# Altium project MB1428.PrjPcb (part 3 of 4)

## Sheet USB_PD_TYPE-C.SchDoc: USB_PD_TYPE-C
size A4; Date: Not used; ApprovedBy: Not used; CheckedBy: Not used; Author: Not used; CompanyName: STMicroelectronics; DrawnBy: Not used; Engineer: Not used; Organization: Not used; Address1: Not used; Address2: Not used; Address3: Not used; Address4: Not used; DocumentNumber: Not used; Revision: Not used; SheetNumber: 5; SheetTotal: 12; CurrentTime: Not used; CurrentDate: Not used; Time: Not used; DocumentFullPathAndName: Not used; DocumentName: Not used; ModifiedDate: Not used; ImagePath: Not used; ProjectName: Not used; Application_BuildNumber: Not used
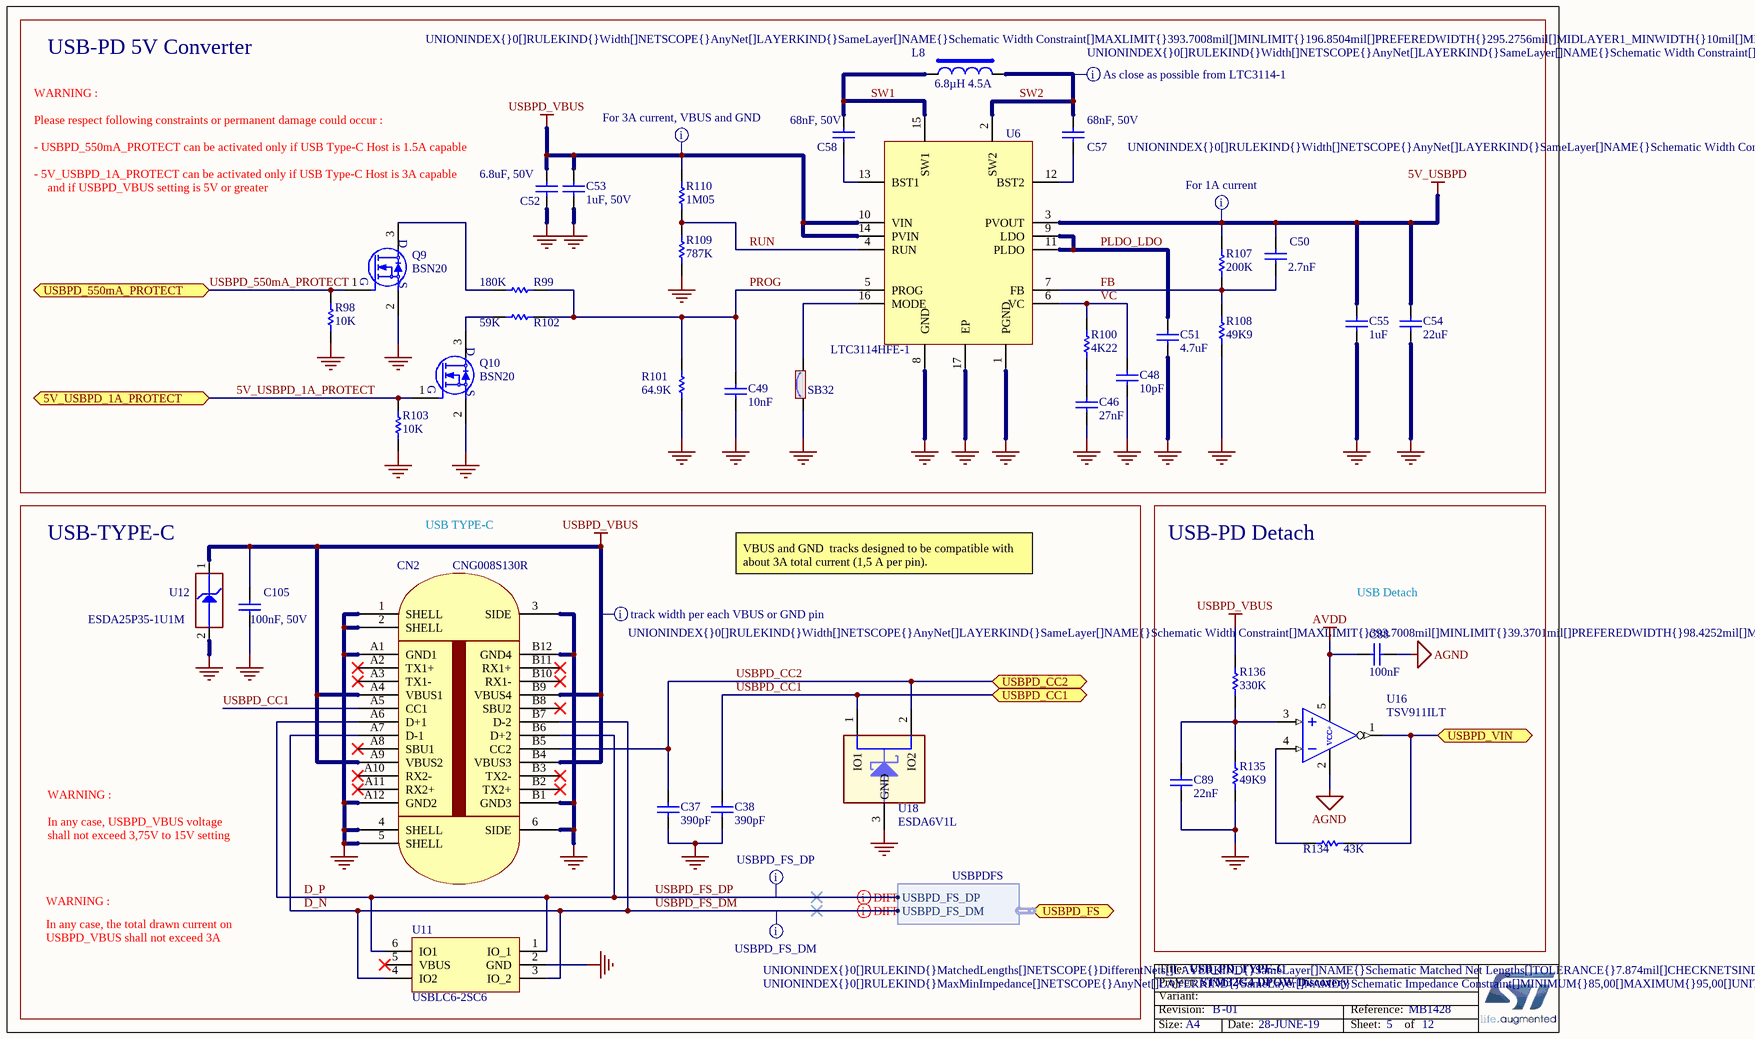
[diagram p8: USB_PD_TYPE-C.SchDoc]

### Parts
C37  value 390pF  [C0402]
C38  value 390pF  [C0402]
C46  value 27nF  [C0805_KEMET_IPC-7351_DENSITY-LEVEL-B_H1P10]  (hidden comment: Capacitor)
C48  value 10pF  [C0603]
C49  value 10nF  [C0603]
C50  value 2.7nF  [C0603_H0P8]  (hidden comment: Capacitor)
C51  value 4.7uF  [C0603]
C52  value 6.8uF, 50V  [C1206_H1P6]
C53  value 1uF, 50V  [C0603_H0P8]  (hidden comment: Capacitor)
C54  value 22uF  [C1210]
C55  value 1uF  [C0603]
C57  value 68nF, 50V  [C0603_H0P8]
C58  value 68nF, 50V  [C0603_H0P8]
C88  value 100nF  [C0402]
C89  value 22nF  [C1206_H0P85]
C105  value 100nF, 50V  [C0603]  (hidden comment: Capacitor)
CN2  value CNG008S130R  [CON_USB-TYPEC_LITKCONN-TECHNOLOGY_CNG008S130R]
L8  value 6.8µH 4.5A  [IND_8040_WURTH_74437358068]
Q9  value BSN20  [MOS_SOT23]
Q10  value BSN20  [MOS_SOT23]
R98  value 10K  [R0603]
R99  value 180K  [R0603]  (hidden comment: Resistor)
R100  value 4K22  [R0603_H0P45]
R101  value 64.9K  [R0603_H0P45]  (hidden comment: Resistor)
R102  value 59K  [R0603_H0P45]  (hidden comment: Resistor)
R103  value 10K  [R0603]
R107  value 200K  [R0603]  (hidden comment: Resistor)
R108  value 49K9  [R0603]  (hidden comment: Resistor)
R109  value 787K  [R0603_H0P45]
R110  value 1M05  [R0603_H0P45]
R134  value 43K  [R0603]
R135  value 49K9  [R0603]
R136  value 330K  [R0603]
SB32  (no value)  [SOLDER-BRIDGE_R0603-0R]
U6  value LTC3114HFE-1  [ICC_TSOP65P640X110_HS-17N]
U11  value USBLC6-2SC6  [ESD_SOT23-6L]
U12  value ESDA25P35-1U1M  [ESD_QFN1610_2N_1K_2A]
U16  value TSV911ILT  [AOP_SOT23-5L_H1P45]
U18  value ESDA6V1L  [ESD_SOT23]

### Blocks framed on the sheet
USB-PD 5V Converter: C46 C48-C55 C57 C58 L8 Q9 Q10 R98-R103 R107-R110 SB32 U6
USB-TYPE-C: C37 C38 C105 CN2 U11 U12 U18
USB-PD Detach: C88 C89 R134-R136 U16

### Ports
5V_USBPD_1A_PROTECT, USBPD_550mA_PROTECT, USBPD_CC1, USBPD_CC2, USBPD_FS (harness USBPDFS), USBPD_VIN

### Harnesses
USBPDFS: USBPD_FS_DM, USBPD_FS_DP

### Nets
5V_USBPD: C50.2 C54.2 C55.2 R107.2 U6.3(PVOUT)
AGND: C88.1 U16.2(VCC-)
AVDD: C88.2 U16.5(VCC+)
GND: C37.1 C38.1 C46.1 C48.1 C49.1 C51.2 C52.1 C53.1 C54.1 C55.1 C89.1 C105.1 CN2.1(SHELL) CN2.2(SHELL) CN2.3(SIDE) CN2.4(SHELL) CN2.5(SHELL) CN2.6(SIDE) CN2.A1(GND1) CN2.A12(GND2) CN2.B1(GND3) CN2.B12(GND4) Q9.2(S) Q10.2(S) R98.1 R101.1 R103.1 R108.1 R109.1 R135.1 SB32.1 U6.1(PGND) U6.8(GND) U6.17(EP) U11.2(GND) U12.2(GND) U18.3(GND)
USBPD_VBUS: C52.2 C53.2 C105.2 CN2.A4(VBUS1) CN2.A9(VBUS2) CN2.B4(VBUS3) CN2.B9(VBUS4) R110.2 R136.2 U6.10(VIN) U6.14(PVIN) U12.1(IO1)
5V_USBPD_1A_PROTECT: Q10.1(G) R103.2 ; port 5V_USBPD_1A_PROTECT
D_N: CN2.A7(D-1) CN2.B7(D-2) U11.3(IO_2) U11.4(IO2) ; port USBPD_FS.USBPD_FS_DM  [also labelled USBPD_FS_DM]
D_P: CN2.A6(D+1) CN2.B6(D+2) U11.1(IO_1) U11.6(IO1) ; port USBPD_FS.USBPD_FS_DP  [also labelled USBPD_FS_DP]
FB: C50.1 R107.1 R108.2 U6.7(FB)
PLDO_LDO: C51.1 U6.9(LDO) U6.11(PLDO)
PROG: C49.2 R99.2 R101.2 R102.2 U6.5(PROG)
RUN: R109.2 R110.1 U6.4(RUN)
SW1: C58.2 L8.1 U6.15(SW1)
SW2: C57.2 L8.2 U6.2(SW2)
USBPD_550mA_PROTECT: Q9.1(G) R98.2 ; port USBPD_550mA_PROTECT
USBPD_CC1: C38.2 CN2.A5(CC1) U18.1(IO1) ; port USBPD_CC1
USBPD_CC2: C37.2 CN2.B5(CC2) U18.2(IO2) ; port USBPD_CC2
USBPD_VIN: R134.2 U16.1(NC) ; port USBPD_VIN
VC: C48.2 R100.2 U6.6(VC)
NetC46_2: C46.2 R100.1
NetC57_1: C57.1 U6.12(BST2)
NetC58_1: C58.1 U6.13(BST1)
NetC89_2: C89.2 R135.2 R136.1 U16.3(IN+)
NetQ9_3: Q9.3(D) R99.1
NetQ10_3: Q10.3(D) R102.1
NetR134_1: R134.1 U16.4(IN-)
NetSB32_2: SB32.2 U6.16(MODE)

Not connected (* = marked no-connect by the designer): CN2 A2(TX1+)* A3(TX1-)* A8(SBU1)* A10(RX2-)* A11(RX2+)* B2(TX2+)* B3(TX2-)* B8(SBU2)* B10(RX1-)* B11(RX1+)*; U11 5(VBUS)*

### Layout directives
differential pair; rule Impedance Constraint [Min = 85.00    Max = 95.00    ]: D_N, D_P
rule Undefined; rule Matched Net Lengths [Tolerance = 0.2mm]; rule Impedance Constraint [Min = 85.00    Max = 95.00    ]: D_N, D_P
rule Width Constraint [Pref Width = 2.5mm    Min Width = 1mm    Max Width = 10mm]: USBPD_VBUS
rule Width Constraint [Pref Width = 5mm    Min Width = 5mm    Max Width = 10mm]: 5V_USBPD, SW2
rule Width Constraint [Pref Width = 7.5mm    Min Width = 5mm    Max Width = 10mm]: USBPD_VBUS

### Notes on the sheet
- WARNING :
- - USBPD_550mA_PROTECT can be activated only if USB Type-C Host is 1.5A capable
- - 5V_USBPD_1A_PROTECT can be activated only if USB Type-C Host is 3A capable
- Please respect following constraints or permanent damage could occur :
- and if USBPD_VBUS setting is 5V or greater
- USB TYPE-C
- VBUS and GND  tracks designed to be compatible with about 3A total current (1,5 A per pin).
- USB Detach
- shall not exceed 3,75V to 15V setting
- In any case, USBPD_VBUS voltage
- In any case, the total drawn current on
- USBPD_VBUS shall not exceed 3A
- Title:
- Project:
- Size:
- Revision:
- Variant:
- A4
- -
- Date:
- Reference:
- Sheet:
- of

### Library data of the parts
C37 C38 = MCD-01597: Capacitor, MLCC, 390pF, 50V, NPO, 5%, 0402, T=0,5mm; Manufacturer_Part_Number: CC0402JRNPO9BN391; Manufacturer: YAGEO; Provided_By: SUBCO; Internal_Part_Number: MCD-01597; Status: Footprint available; Part_Type: Capacitor; Package: C0402; ComponentLink1Description: Datasheet; ComponentLink1URL: http://tunmcdsvn.tun.st.com/Component_Datasheet_Library/Trunk/Capacitors/Yageo_Capacitor_NP0_16V-to-50V
C46 = MCD-01719: Capacitor, MLCC, 27nF, 25V, C0G, 5%, 0805, T=1.1mm; Manufacturer_Part_Number: C0805C273J3GACTU; Manufacturer: KEMET; Internal_Part_Number: MCD-01719; Status: Footprint available; Part_Type: Capacitor; Package: C0805; ComponentLink1Description: Datasheet; ComponentLink1URL: http://tunmcdsvn.tun.st.com/Component_Datasheet_Library/Trunk/Capacitors/KEMET_Capacitor_C0G-series/KEMET_Capacitor_C0G-series.pdf; Provided_By: n/a
C48 = MCD-00637: Capacitor, MLCC, 10pF, 50V, NPO, 5%, 0603, T=0,8mm; Manufacturer_Part_Number: CC0603JRNPO9BN100; Manufacturer: YAGEO; Provided_By: SUBCO; Internal_Part_Number: MCD-00637; Status: Released; Part_Type: Capacitor; Package: C0603; ComponentLink1Description: Datasheet; ComponentLink1URL: http://tunmcdsvn.tun.st.com/Component_Datasheet_Library/Trunk/Capacitors/Yageo_Capacitor_NP0_16V-to-50V
C49 = MCD-01007: Capacitor, MLCC, 10nF, 16V, X7R, 10%, 0603, T=0.8mm; Manufacturer_Part_Number: CC0603KRX7R7BB103; Manufacturer: YAGEO; Provided_By: SUBCO; Internal_Part_Number: MCD-01007; Status: Released; Part_Type: Capacitor; Package: C0603; ComponentLink1Description: Datasheet; ComponentLink1URL: http://tunmcdsvn.tun.st.com/Component_Datasheet_Library/Trunk/Capacitors/Yageo_Multilayer_Capacitor_X7R_series_100pF_to_22uF/
C50 = MCD-01923: Capacitor, MLCC, 2.7nF, 16V, NPO, 5%, 0603, T=0,8mm; Manufacturer_Part_Number: CC0603JRNPO7BN272; Manufacturer: YAGEO; Provided_By: SUBCO; Internal_Part_Number: MCD-01923; Status: Footprint available; Part_Type: Capacitor; Package: C0603; ComponentLink1Description: Datasheet; ComponentLink1URL: http://tunmcdsvn.tun.st.com/Component_Datasheet_Library/Trunk/Capacitors/Yageo_UPY-GP_NP0_16V-to-50V/YAGEO_NP0_UPY-GP_NP0_16V-to-50V_16.pdf; ECCN_US: n/a; ECCN_EU: n/a
C51 = MCD-00009: Capacitor, MLCC, 4.7uF, 16V, X5R, 10%, 0603, T=0.8mm; Manufacturer_Part_Number: CC0603KRX5R7BB475; Manufacturer: YAGEO; Provided_By: SUBCO; Internal_Part_Number: MCD-00009; Status: Released; Part_Type: Capacitor; Package: C0603; ComponentLink1Description: Datasheet; ComponentLink1URL: http://tunmcdsvn.tun.st.com/Component_Datasheet_Library/Trunk/Capacitors/Yageo_Multilayer_capacitor_X5R_series_100pF_to_100uF
C52 = MCD-01559: Capacitor, MLCC, 6.8uF, 50V, X5R, 10%, 1206, T=1.6mm; Manufacturer_Part_Number: C3216X5R1H685K160AB; Manufacturer: TDK; Provided_By: SUBCO; Internal_Part_Number: MCD-01559; Status: Footprint available; Part_Type: Capacitor; Package: C1206; ComponentLink1Description: Datasheet; ComponentLink1URL: http://tunmcdsvn.tun.st.com/Component_Datasheet_Library/Trunk/Capacitors/TDK_Capacitor_MCC_series/TDK_Capacitor_MCC_series.pdf
C53 = MCD-01703: Capacitor,1uF,50V,X5R,10%,0603, T=0.8mm; Manufacturer_Part_Number: CC0603KRX5R9BB105; Manufacturer: YAGEO; Provided_By: SUBCO; Internal_Part_Number: MCD-01703; Status: Footprint available; Part_Type: Capacitor; Package: C0603; ComponentLink1Description: Datasheet; ComponentLink1URL: http://tunmcdsvn.tun.st.com/Component_Datasheet_Library/Trunk/Capacitors/Yageo_Multilayer_capacitor_X5R_series_100pF_to_100uF/YAGEO_MLCC_UPY-GPHC_X5R_4V-to-50V_25.pdf
C54 = MCD-00614: Capacitor, MLCC, 22uF, 16V, 1210, X7R, 20%, T=2,5mm, ESR 2mohm@410KHz; Manufacturer_Part_Number: GCM32ER71C226ME19; Manufacturer: MURATA; Provided_By: SUBCO; Internal_Part_Number: MCD-00614; Status: Checked; Part_Type: Capacitor; Package: C1210; ComponentLink1Description: Datasheet; ComponentLink1URL: http://tunmcdsvn.tun.st.com/Component_Datasheet_Library/Trunk/Capacitors/Murata_Capacitor_GC_series
C55 = MCD-00010: Capacitor, MLCC, 1uF, 16V, X5R, 10%, 0603, T=0,8mm; Manufacturer_Part_Number: CC0603KRX5R7BB105; Manufacturer: YAGEO; Provided_By: SUBCO; Internal_Part_Number: MCD-00010; Status: Released; Part_Type: Capacitor; Package: C0603; ComponentLink1Description: Datasheet; ComponentLink1URL: http://tunmcdsvn.tun.st.com/Component_Datasheet_Library/Trunk/Capacitors/Yageo_Multilayer_capacitor_X5R_series_100pF_to_100uF
C57 C58 = MCD-01667: Capacitor, MLCC, 68nF, 50V, X7R, 10%, 0603, T=0.8mm; Manufacturer_Part_Number: CC0603KRX7R9BB683; Manufacturer: YAGEO; Provided_By: SUBCO; Internal_Part_Number: MCD-01667; Status: Footprint available; Part_Type: Capacitor; Package: C0603; ComponentLink1Description: Datasheet; ComponentLink1URL: http://tunmcdsvn.tun.st.com/Component_Datasheet_Library/Trunk/Capacitors/Yageo_Multilayer_Capacitor_X7R_series_100pF_to_22uF/YAGEO_MLCC_UPY-GPHC_X7R_6.3V-to-50V_18.pdf
C88 = MCD-00102: Capacitor, MLCC, 100nF, 16V, X7R, 10%, 0402, T=0,5mm; Manufacturer_Part_Number: CC0402KRX7R7BB104; Manufacturer: YAGEO; Alternate_Manufacturer_Part_Number: GCM155R71C104KA55D; Alternate_Manufacturer: MURATA; Provided_By: SUBCO; Internal_Part_Number: MCD-00102; Status: Released; Package: C0402; ComponentLink1Description: Datasheet; Part_Type: Capacitor; ComponentLink1URL: http://tunmcdsvn.tun.st.com/Component_Datasheet_Library/Trunk/Capacitors/Yageo_Multilayer_Capacitor_X7R_series_100pF_to_22uF
C89 = MCD-01184: Capacitor, COG, 22nF,50V, X7S, 5%, 1206, T=0.85mm; Manufacturer_Part_Number: GRM3195C1H223JA01L; Manufacturer: MURATA; Provided_By: SUBCO; Internal_Part_Number: MCD-01184; Status: Released; Part_Type: Capacitor; Package: C1206; ComponentLink1Description: Datasheet; ComponentLink1URL: http://tunmcdsvn.tun.st.com/Component_Datasheet_Library/Trunk/Capacitors/Murata_Capacitor_GR_series
C105 = MCD-01099: Capacitor,100nF,50V,X7R,10%,0603; Manufacturer_Part_Number: CC0603KRX7R9BB104; Manufacturer: YAGEO; Provided_By: SUBCO; Internal_Part_Number: MCD-01099; Status: Footprint available; Part_Type: Capacitor; Package: C0603; ComponentLink1Description: Datasheet; ComponentLink1URL: http://tunmcdsvn.tun.st.com/Component_Datasheet_Library/Trunk/Capacitors/Yageo_Multilayer_Capacitor_X7R_series_100pF_to_22uF/Yageo_Mutilayer_Capacitor_X7R_100pF_to_22uF.pdf
CN2 = MCD-01679: USB Type C certified Connector SMT Mid-mount; Manufacturer: LITKCON TECHNOLOGY; Provided_By: SUBCO; Internal_Part_Number: MCD-01679; Status: Footprint available; Part_Type: Connector; Manufacturer_Part_Number: CNG008S130R; ComponentLink1Description: Datasheet; ComponentLink1URL: http://tunmcdsvn.tun.st.com/Component_Datasheet_Library/Trunk/Connectors/LITKCON_TECHNOLOGY_USBTypeC_CNG008S130R/LITKCON_TECHNOLOGY_USBTypeC_CNG008S130R.pdf
L8 = MCD-01372: Inductor 6.8µH +/-20% Isat= 13.5A DCR=33.40 mOhm; Manufacturer_Part_Number: 744 373 580 68; Manufacturer: WURTH; Provided_By: SUBCO; Internal_Part_Number: MCD-01372; Status: Footprint available; Part_Type: Inductor; Package: WE-LHMI_SMD_8040; ComponentLink1Description: Datasheet; ComponentLink1URL: http://tunmcdsvn.tun.st.com/Component_Datasheet_Library/Trunk/Inductors/WURTH_SMD_Power_Inductor_74437358068
Q9 Q10 = MCD-00151: N-channel enhancement mode field-effect transistor; Part_Type: IC; Manufacturer: NXP; Provided_By: SUBCO; Internal_Part_Number: MCD-00151; Status: Released; Manufacturer_Part_Number: BSN20; ComponentLink1Description: Datasheet; ComponentLink1URL: http://tunmcdsvn.tun.st.com/Component_Datasheet_Library/Trunk/IC/NXP_Transistor_BSN20BK_SOT23
R98 R103 = MCD-00220: Resistor,10K,0603,1%,1/10W; Manufacturer_Part_Number: RC0603FR-0710KL; Manufacturer: YAGEO; Provided_By: SUBCO; Internal_Part_Number: MCD-00220; Status: Released; Part_Type: Resistor; Package: R0603; ComponentLink1Description: Datasheet; ComponentLink1URL: http://tunmcdsvn.tun.st.com/Component_Datasheet_Library/Trunk/Resistors/Yageo_Resistor_RC0603-series
R99 = MCD-00414: Resistor,180K,0603,1%,1/10W; Manufacturer_Part_Number: RC0603FR-07180KL; Manufacturer: YAGEO; ECCN_US: EAR99; ECCN_EU: NEC; Provided_By: SUBCO; Internal_Part_Number: MCD-00414; Status: Released; Part_Type: Resistor; Package: R0603; ComponentLink1Description: Datasheet; ComponentLink1URL: http://tunmcdsvn.tun.st.com/Component_Datasheet_Library/Trunk/Resistors/Yageo_Resistor_RC0603-series
R100 = MCD-01571: Resistor, 4K22, 0603, 1%, 1/10W; Manufacturer_Part_Number: RC0603FR-074K22L; Manufacturer: YAGEO; Provided_By: SUBCO; Internal_Part_Number: MCD-01571; Status: Footprint available; Part_Type: Resistor; Package: R0603; ComponentLink1Description: Datasheet; ComponentLink1URL: http://tunmcdsvn.tun.st.com/Component_Datasheet_Library/Trunk/Resistors/Yageo_Resistor_RC0603-series
R101 = MCD-01793: Resistor, 64.9K, 0603, 1%, 1/10W; Manufacturer_Part_Number: RC0603FR-0764K9L; Manufacturer: YAGEO; ECCN_US: EAR99; ECCN_EU: NEC; Provided_By: SUBCO; Internal_Part_Number: MCD-01793; Status: Footprint available; Part_Type: Resistor; Package: R0603; ComponentLink1Description: Datasheet; ComponentLink1URL: http://tunmcdsvn.tun.st.com/Component_Datasheet_Library/Trunk/Resistors/Yageo_Resistor_RC0603-series
R102 = MCD-01794: Resistor, 59K, 0603, 1%, 1/10W; Manufacturer_Part_Number: RC0603FR-0759KL; Manufacturer: YAGEO; ECCN_US: EAR99; ECCN_EU: NEC; Provided_By: SUBCO; Internal_Part_Number: MCD-01794; Status: Footprint available; Part_Type: Resistor; Package: R0603; ComponentLink1Description: Datasheet; ComponentLink1URL: http://tunmcdsvn.tun.st.com/Component_Datasheet_Library/Trunk/Resistors/Yageo_Resistor_RC0603-series
R107 = MCD-00424: Resistor,200K,0603,1%,1/10W; Manufacturer_Part_Number: RC0603FR-07200KL; Manufacturer: YAGEO; ECCN_US: EAR99; ECCN_EU: NEC; Provided_By: SUBCO; Internal_Part_Number: MCD-00424; Status: Released; Part_Type: Resistor; Package: R0603; ComponentLink1Description: Datasheet; ComponentLink1URL: http://tunmcdsvn.tun.st.com/Component_Datasheet_Library/Trunk/Resistors/Yageo_Resistor_RC0603-series
R108 = MCD-01171: Resistor,49K9,0603,1%; Manufacturer_Part_Number: RC0603FR-0749K9L; Manufacturer: YAGEO; ECCN_US: EAR99; ECCN_EU: NEC; Provided_By: SUBCO; Internal_Part_Number: MCD-01171; Status: Released; Part_Type: Resistor; Package: R0603; ComponentLink1Description: Datasheet; ComponentLink1URL: http://tunmcdsvn.tun.st.com/Component_Datasheet_Library/Trunk/Resistors/Yageo_Resistor_RC0603-series/
R109 = MCD-01568: Resistor, 787K, 0603, 1%, 1/10W; Manufacturer_Part_Number: RC0603FR-07787KL; Manufacturer: YAGEO; Provided_By: SUBCO; Internal_Part_Number: MCD-01568; Status: Footprint available; Part_Type: Resistor; Package: R0603; ComponentLink1Description: Datasheet; ComponentLink1URL: http://tunmcdsvn.tun.st.com/Component_Datasheet_Library/Trunk/Resistors/Yageo_Resistor_RC0603-series
R110 = MCD-01569: Resistor, 1M05, 0603, 1%, 1/10W; Manufacturer_Part_Number: RC0603FR-071M05L; Manufacturer: YAGEO; Provided_By: SUBCO; Internal_Part_Number: MCD-01569; Status: Footprint available; Part_Type: Resistor; Package: R0603; ComponentLink1Description: Datasheet; ComponentLink1URL: http://tunmcdsvn.tun.st.com/Component_Datasheet_Library/Trunk/Resistors/Yageo_Resistor_RC0603-series
R134 = MCD-00478: Resistor,43K,0603,1%,1/10W; Manufacturer_Part_Number: RC0603FR-0743KL; Manufacturer: YAGEO; Provided_By: SUBCO; Internal_Part_Number: MCD-00478; Status: Released; Part_Type: Resistor; Package: R0603; ComponentLink1Description: Datasheet; ComponentLink1URL: http://tunmcdsvn.tun.st.com/Component_Datasheet_Library/Trunk/Resistors/Yageo_Resistor_RC0603-series
R135 = MCD-01171: Resistor,49K9,0603,1%; Manufacturer_Part_Number: RC0603FR-0749K9L; Manufacturer: YAGEO; Provided_By: SUBCO; Internal_Part_Number: MCD-01171; Status: Released; Part_Type: Resistor; Package: R0603; ComponentLink1Description: Datasheet; ComponentLink1URL: http://tunmcdsvn.tun.st.com/Component_Datasheet_Library/Trunk/Resistors/Yageo_Resistor_RC0603-series/
R136 = MCD-00458: Resistor,330K,0603,1%,1/10W; Manufacturer_Part_Number: RC0603FR-07330KL; Manufacturer: YAGEO; Provided_By: SUBCO; Internal_Part_Number: MCD-00458; Status: Released; Part_Type: Resistor; Package: R0603; ComponentLink1Description: Datasheet; ComponentLink1URL: http://tunmcdsvn.tun.st.com/Component_Datasheet_Library/Trunk/Resistors/Yageo_Resistor_RC0603-series
SB32 = MCD-00071: Solder Bridge ON; Part_Type: Mechanical; Manufacturer_Part_Number: RC0603JR-070RL; Manufacturer: YAGEO; Provided_By: SUBCO; Internal_Part_Number: MCD-00071; Status: Released; Package: SB0603; ComponentLink1Description: Datasheet; ComponentLink1URL: http://tunmcdsvn.tun.st.com/Component_Datasheet_Library/Trunk/Resistors/Yageo_Resistor_RC0603-series
U6 = MCD-01593: Integrated Circuit 40V, 1A Synchronous Buck-Boost DC/DC Converter with Programmable Output Current, -40°C to 150°C; Part_Type: IC; Manufacturer_Part_Number: LTC3114HFE-1-TRPBF; Manufacturer: LINEAR TECHNOLOGY; Provided_By: SUBCO; Internal_Part_Number: MCD-01593; Status: Footprint available; Package: 16-Lead Plastic TSSOP + exposed pad; ComponentLink1Description: Datasheet; ComponentLink1URL: http://tunmcdsvn.tun.st.com/Component_Datasheet_Library/Trunk/IC/LINEAR_TECHNOLOGY_Buck_Boost_Converter_LTC3114-1
U11 = MCD-00163: Very low capacitance ESD protection; Part_Type: IC; Manufacturer: STMICROELECTRONICS; BMS_Part_Number: 9151075; Provided_By: SUBCO with ST control; Internal_Part_Number: MCD-00163; Status: Released; Manufacturer_Part_Number: USBLC6-2SC6; ComponentLink1Description: Datasheet; ComponentLink1URL: http://tunmcdsvn.tun.st.com/Component_Datasheet_Library/Trunk/Diodes/STM_ESD_USBLC6-2
U12 = MCD-01207: High power Transient voltage suppressor:25V/35A EOS and ESD transients protection.; Part_Type: Diode; Manufacturer: STMICROELECTRONICS; BMS_Part_Number: 9179045; Provided_By: SUBCO with ST control; Internal_Part_Number: MCD-01207; Status: Checked; Manufacturer_Part_Number: ESDA25P35-1U1M; Package: QFN1610; ComponentLink1Description: Datasheet; ComponentLink1URL: http://tunmcdsvn.tun.st.com/Component_Datasheet_Library/Trunk/Diodes/STM_ESD_ESDA25P35-1U1M
U16 = MCD-01192: Single, dual, and quad rail to rail input/ouput 8Mhz operational amplifiers; Part_Type: IC; Manufacturer: STMICROELECTRONICS; BMS_Part_Number: 9177436; Provided_By: SUBCO with ST control; Internal_Part_Number: MCD-01192; Status: Checked; Manufacturer_Part_Number: TSV911ILT; Package: SOT23-5; ComponentLink1Description: Datasheet; ComponentLink1URL: http://tunmcdsvn.tun.st.com/Component_Datasheet_Library/Trunk/IC/STM_Amp_TSV91xx
U18 = MCD-00255: Dual Transil array ESD protection; Part_Type: Diode; Manufacturer: STMICROELECTRONICS; BMS_Part_Number: 9179033; Provided_By: SUBCO with ST control; Internal_Part_Number: MCD-00255; Status: Released; Manufacturer_Part_Number: ESDA6V1L; ComponentLink1Description: Datasheet; ComponentLink1URL: http://tunmcdsvn.tun.st.com/Component_Datasheet_Library/Trunk/Diodes/STM_ESD_ESDAxxL

## Sheet RGB_LED_BUCK_Converters.SchDoc: RGB_LED_BUCK_Converters
size A4; Date: Not used; ApprovedBy: Not used; CheckedBy: Not used; Author: Not used; CompanyName: STMicroelectronics; DrawnBy: Not used; Engineer: Not used; Organization: Not used; Address1: Not used; Address2: Not used; Address3: Not used; Address4: Not used; DocumentNumber: Not used; Revision: Not used; SheetNumber: 6; SheetTotal: 12; CurrentTime: Not used; CurrentDate: Not used; Time: Not used; DocumentFullPathAndName: Not used; DocumentName: Not used; ModifiedDate: Not used; ImagePath: Not used; ProjectName: Not used; Application_BuildNumber: Not used
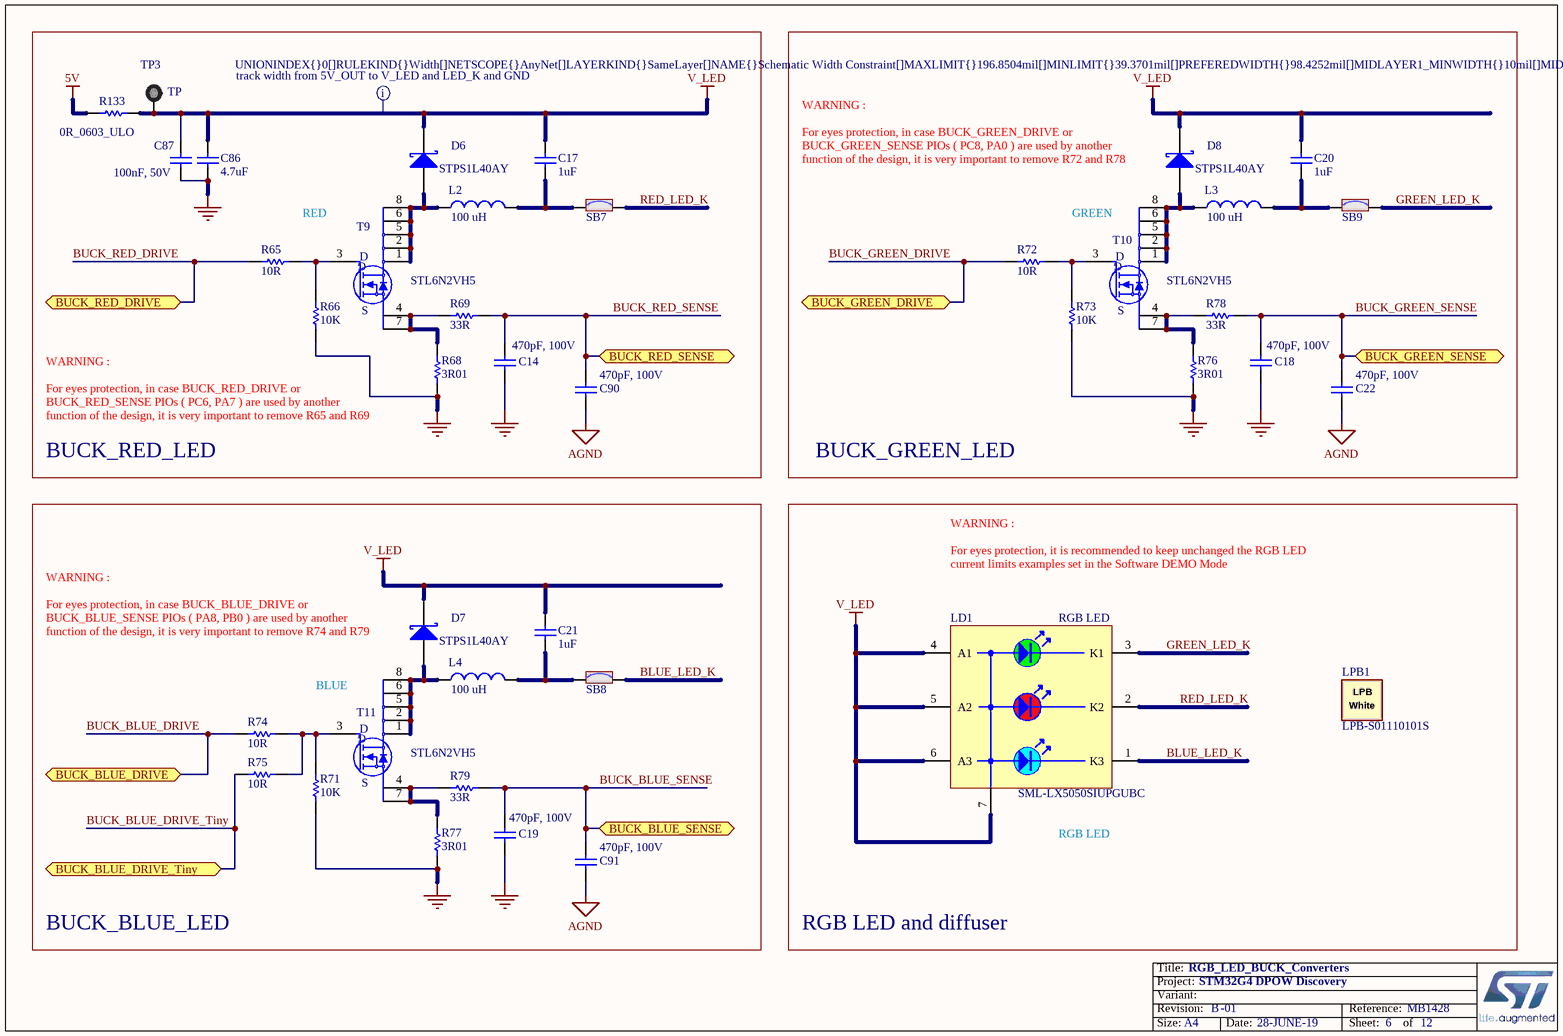
[diagram p9: RGB_LED_BUCK_Converters.SchDoc]

### Parts
C14  value 470pF, 100V  [C0603_H0P8]  (hidden comment: Capacitor)
C17  value 1uF  [C0805_H0P85]
C18  value 470pF, 100V  [C0603_H0P8]  (hidden comment: Capacitor)
C19  value 470pF, 100V  [C0603_H0P8]  (hidden comment: Capacitor)
C20  value 1uF  [C0805_H0P85]
C21  value 1uF  [C0805_H0P85]
C22  value 470pF, 100V  [C0603_H0P8]  (hidden comment: Capacitor)
C86  value 4.7uF  [C0603]
C87  value 100nF, 50V  [C0805_H0P85]
C90  value 470pF, 100V  [C0603_H0P8]  (hidden comment: Capacitor)
C91  value 470pF, 100V  [C0603_H0P8]  (hidden comment: Capacitor)
D6  value STPS1L40AY  [DIO_SMA_1A_2K]
D7  value STPS1L40AY  [DIO_SMA_1A_2K]
D8  value STPS1L40AY  [DIO_SMA_1A_2K]
L2  value 100 uH  [IND_SUNLORD_SWPA5040S]  (hidden comment: Inductor)
L3  value 100 uH  [IND_SUNLORD_SWPA5040S]  (hidden comment: Inductor)
L4  value 100 uH  [IND_SUNLORD_SWPA5040S]  (hidden comment: Inductor)
LD1  value RGB LED  Manufacturer_Part_Number: SML-LX5050SIUPGUBC  [LED_PLCC6-EPAD_LUMEX_SML-LX5050SIUPGUBC]
LPB1  LPB-S01110101S  [LIGHT_10MM-SQUARE-LIGHT-BAR_LUMEX_LPB-S01110101S]
R65  value 10R  [R0805_H0P5]
R66  value 10K  [R0805]
R68  value 3R01  [R1206_H0P55]
R69  value 33R  [R0603]
R71  value 10K  [R0805]
R72  value 10R  [R0805_H0P5]
R73  value 10K  [R0805]
R74  value 10R  [R0805_H0P5]
R75  value 10R  [R0805_H0P5]
R76  value 3R01  [R1206_H0P55]
R77  value 3R01  [R1206_H0P55]
R78  value 33R  [R0603]
R79  value 33R  [R0603]
R133  value 0R_0603_ULO  [R0603]
SB7  (no value)  [SOLDER-BRIDGE_R0603-0R]
SB8  (no value)  [SOLDER-BRIDGE_R0603-0R]
SB9  (no value)  [SOLDER-BRIDGE_R0603-0R]
T9  value STL6N2VH5  [MOS_POWERFLAT_2X2_P065]
T10  value STL6N2VH5  [MOS_POWERFLAT_2X2_P065]
T11  value STL6N2VH5  [MOS_POWERFLAT_2X2_P065]
TP3  value TP  [TP_PTH_1MM_2MM]

### Blocks framed on the sheet
BUCK_RED_LED: C14 C17 C86 C87 C90 D6 L2 R65 R66 R68 R69 R133 SB7 T9 TP3
BUCK_GREEN_LED: C18 C20 C22 D8 L3 R72 R73 R76 R78 SB9 T10
BUCK_BLUE_LED: C19 C21 C91 D7 L4 R71 R74 R75 R77 R79 SB8 T11
RGB LED and diffuser: LD1 LPB1

### Ports
BUCK_BLUE_DRIVE, BUCK_BLUE_DRIVE_Tiny, BUCK_BLUE_SENSE, BUCK_GREEN_DRIVE, BUCK_GREEN_SENSE, BUCK_RED_DRIVE, BUCK_RED_SENSE

### Nets
5V: R133.1
AGND: C22.1 C90.1 C91.1
GND: C14.1 C18.1 C19.1 C86.1 C87.1 R66.1 R68.1 R71.1 R73.1 R76.1 R77.1
V_LED: C17.2 C20.2 C21.2 C86.2 C87.2 D6.2(K) D7.2(K) D8.2(K) LD1.4(A1) LD1.5(A2) LD1.6(A3) LD1.7(SLUG) R133.2 TP3.1
BLUE_LED_K: LD1.1(K3) SB8.2
BUCK_BLUE_DRIVE: R74.1 ; port BUCK_BLUE_DRIVE
BUCK_BLUE_DRIVE_Tiny: R75.1 ; port BUCK_BLUE_DRIVE_Tiny
BUCK_BLUE_SENSE: C19.2 C91.2 R79.2 ; port BUCK_BLUE_SENSE
BUCK_GREEN_DRIVE: R72.1 ; port BUCK_GREEN_DRIVE
BUCK_GREEN_SENSE: C18.2 C22.2 R78.2 ; port BUCK_GREEN_SENSE
BUCK_RED_DRIVE: R65.1 ; port BUCK_RED_DRIVE
BUCK_RED_SENSE: C14.2 C90.2 R69.2 ; port BUCK_RED_SENSE
GREEN_LED_K: LD1.3(K1) SB9.2
RED_LED_K: LD1.2(K2) SB7.2
NetC17_1: C17.1 L2.2 SB7.1
NetC20_1: C20.1 L3.2 SB9.1
NetC21_1: C21.1 L4.2 SB8.1
NetD6_1: D6.1(A) L2.1 T9.1(D) T9.2(D) T9.5(D) T9.6(D) T9.8(D)
NetD7_1: D7.1(A) L4.1 T11.1(D) T11.2(D) T11.5(D) T11.6(D) T11.8(D)
NetD8_1: D8.1(A) L3.1 T10.1(D) T10.2(D) T10.5(D) T10.6(D) T10.8(D)
NetR65_2: R65.2 R66.2 T9.3(G)
NetR68_2: R68.2 R69.1 T9.4(S) T9.7(S)
NetR71_2: R71.2 R74.2 R75.2 T11.3(G)
NetR72_2: R72.2 R73.2 T10.3(G)
NetR76_2: R76.2 R78.1 T10.4(S) T10.7(S)
NetR77_2: R77.2 R79.1 T11.4(S) T11.7(S)

### Layout directives
rule Width Constraint [Pref Width = 2.5mm    Min Width = 1mm    Max Width = 5mm]: V_LED

### Notes on the sheet
- WARNING :
- For eyes protection, in case BUCK_GREEN_DRIVE or
- (near D8) function of the design, it is very important to remove R72 and R78
- BUCK_GREEN_SENSE PIOs ( PC8, PA0 ) are used by another
- RED
- (near T10) GREEN
- For eyes protection, in case BUCK_RED_DRIVE or
- BUCK_RED_SENSE PIOs ( PC6, PA7 ) are used by another
- (near R68) function of the design, it is very important to remove R65 and R69
- For eyes protection, it is recommended to keep unchanged the RGB LED
- current limits examples set in the Software DEMO Mode
- For eyes protection, in case BUCK_BLUE_DRIVE or
- (near D7) function of the design, it is very important to remove R74 and R79
- BUCK_BLUE_SENSE PIOs ( PA8, PB0 ) are used by another
- (near T11) BLUE
- (near LD1) RGB LED
- Title:
- Project:
- Size:
- Revision:
- Variant:
- A4
- -
- Date:
- Reference:
- Sheet:
- of
- (in symbol MCD-01191) LPB; White

### Library data of the parts
C14 C18 C19 C22 C90 C91 = MCD-01731: Capacitor, MLCC, 470pF, 100V, X7R, 10%, 0603, T=0.8mm; Manufacturer_Part_Number: CC0603KRX7R0BB471; Manufacturer: YAGEO; Provided_By: SUBCO; Internal_Part_Number: MCD-01731; Status: Footprint available; Part_Type: Capacitor; Package: C0603; ComponentLink1Description: Datasheet; ComponentLink1URL: http://tunmcdsvn.tun.st.com/Component_Datasheet_Library/Trunk/Capacitors/Yageo_Multilayer_Capacitor_NPO_X7R_100V_to_630V_0.47pF%20to%202.2uF/Yageo_Multilayer_Capacitor_NPO_X7R_V21_100V_to_630V_0.47pF_to_2.2uF.pdf
C17 C20 C21 = MCD-01550: Capacitor, MLCC, 1uF, 16V, X5R, 10%, 0805, T=0.85mm; Manufacturer_Part_Number: CC0805KRX5R7BB105; Manufacturer: YAGEO; Provided_By: SUBCO; Internal_Part_Number: MCD-01550; Status: Footprint available; Part_Type: Capacitor; Package: C0805; ComponentLink1Description: Datasheet; ComponentLink1URL: http://tunmcdsvn.tun.st.com/Component_Datasheet_Library/Trunk/Capacitors/Yageo_Multilayer_Capacitor_X7R_series_100pF_to_22uF/YAGEO_MLCC_UPY-GPHC_X7R_6.3V-to-50V_18.pdf
C86 = MCD-00009: as C51 on sheet USB_PD_TYPE-C; Internal_Part_Number: MCD-00009; Status: Released; Part_Type: Capacitor; Package: C0603; ComponentLink1Description: Datasheet; ComponentLink1URL: http://tunmcdsvn.tun.st.com/Component_Datasheet_Library/Trunk/Capacitors/Yageo_Multilayer_capacitor_X5R_series_100pF_to_100uF
C87 = MCD-01525: Capacitor, MLCC, 100nF, 50V, X7R, 10%, 0805, T=0,85mm; Manufacturer_Part_Number: CC0805KRX7R9BB104; Manufacturer: YAGEO; Provided_By: SUBCO; Internal_Part_Number: MCD-01525; Status: Footprint available; Part_Type: Capacitor; Package: C0805; ComponentLink1Description: Datasheet; ComponentLink1URL: http://tunmcdsvn.tun.st.com/Component_Datasheet_Library/Trunk/Capacitors/Yageo_Multilayer_Capacitor_X7R_series_100pF_to_22uF/Yageo_Mutilayer_Capacitor_X7R_100pF_to_22uF.pdf
D6-D8 = MCD-00606: Low Drop power Schottky rectifier(1A, 40V, 0.37 V); Part_Type: Diode; Manufacturer: STMICROELECTRONICS; BMS_Part_Number: 9151017; Provided_By: SUBCO with ST control; Internal_Part_Number: MCD-00606; Status: Checked; Manufacturer_Part_Number: STPS1L40AY; Package: SMA; ComponentLink1Description: Datasheet; ComponentLink1URL: http://tunmcdsvn.tun.st.com/Component_Datasheet_Library/Trunk/Diodes/STM_SCHOTTKY_STPS1L40AY
L2-L4 = MCD-01734: SMD Wire wound power inductor, 100uH, 20%, Isat 0.9A, 560mohm, 5.0x5.0x4.0mm; Manufacturer_Part_Number: SWPA5040S101MT; Manufacturer: SUNLORD; Provided_By: SUBCO; Internal_Part_Number: MCD-01734; Status: Footprint available; Part_Type: Inductor; ComponentLink1Description: Datasheet; ComponentLink1URL: http://tunmcdsvn.tun.st.com/Component_Datasheet_Library/Trunk/Inductors/SUNLORD_Power_Inductor_SWPA5040S-Series/SUNLORD_Power_Inductor_SWPA5040S-Series.pdf
LD1 = MCD-01580: Mid Power RGB LED , SMD, 3x150 mA; Part_Type: Display; Manufacturer: LUMEX; Provided_By: SUBCO; Internal_Part_Number: MCD-01580; Status: Footprint available; ComponentLink1Description: Datasheet; ComponentLink1URL: http://tunmcdsvn.tun.st.com/Component_Datasheet_Library/Trunk/Display/LUMEX_LED_RGB_SML-LX5050SIUPGUBC/LUMEX_LED_SML-LX5050SIUPGUBC.pdf
LPB1 = MCD-01191: 10mm Square Light Bar.; Part_Type: Misc; Manufacturer: LUMEX; Alternate_Manufacturer_Part_Number: LPB-S01110101S-110945; Provided_By: SUBCO; Internal_Part_Number: MCD-01191; Status: Footprint available; Manufacturer_Part_Number: LPB-S01110101S; Alternate_Manufacturer: LUMEX; ComponentLink1Description: Datasheet; ComponentLink1URL: http://tunmcdsvn.tun.st.com/Component_Datasheet_Library/Trunk/Misc/LUMEX_LPB-S01110101S
R65 R72 R74 R75 = MCD-01548: Resistor,10R,0805,1%, 1/8W; Manufacturer_Part_Number: RC0805FR-0710RL; Manufacturer: YAGEO; Provided_By: SUBCO; Internal_Part_Number: MCD-01548; Status: Footprint available; Part_Type: Resistor; Package: R0805; ComponentLink1Description: Datasheet; ComponentLink1URL: http://tunmcdsvn.tun.st.com/Component_Datasheet_Library/Trunk/Resistors/Yageo_Resistor_RC0805-series/Yageo_Resistor_RC0805-series.pdf
R66 R71 R73 = MCD-01154: Resistor,10K,0805,1%,1/8W; Manufacturer_Part_Number: RC0805FR-0710KL; Manufacturer: YAGEO; Provided_By: SUBCO; Internal_Part_Number: MCD-01154; Status: Released; Part_Type: Resistor; Package: R0805; ComponentLink1Description: Datasheet; ComponentLink1URL: http://tunmcdsvn.tun.st.com/Component_Datasheet_Library/Trunk/Resistors/Yageo_Resistor_RC0805-series
R68 R76 R77 = MCD-01528: Resistor, 3R01, 1206, 1%, 1/4W; Manufacturer_Part_Number: RC1206FR-073R01L; Manufacturer: YAGEO; Provided_By: SUBCO; Internal_Part_Number: MCD-01528; Status: Footprint available; Part_Type: Resistor; Package: R1206; ComponentLink1Description: Datasheet; ComponentLink1URL: http://tunmcdsvn.tun.st.com/Component_Datasheet_Library/Trunk/Resistors/Yageo_Resistor_RC1206-series/Yageo_Resistor_RC1206-series.pdf
R69 R78 R79 = MCD-00456: Resistor,33R,0603,1%,1/10W; Manufacturer_Part_Number: RC0603FR-0733RL; Manufacturer: YAGEO; BMS_Part_Number: 9129732; Provided_By: SUBCO; Internal_Part_Number: MCD-00456; Status: Released; Part_Type: Resistor; Package: R0603; ComponentLink1Description: Datasheet; ComponentLink1URL: http://tunmcdsvn.tun.st.com/Component_Datasheet_Library/Trunk/Resistors/Yageo_Resistor_RC0603-series
R133 = MCD-00181: Resistor,0R,0603,ULO; Manufacturer_Part_Number: PMR03EZPJ000; Manufacturer: ROHM; Provided_By: SUBCO; Internal_Part_Number: MCD-00181; Status: Released; Part_Type: Resistor; Package: R0603; ComponentLink1Description: Datasheet; ComponentLink1URL: http://tunmcdsvn.tun.st.com/Component_Datasheet_Library/Trunk/Resistors/ROHM_ULtra_low_Ohmic_Resistor_PMR10EZPJ000
SB7-SB9 = MCD-00071: as SB32 on sheet USB_PD_TYPE-C; Internal_Part_Number: MCD-00071; Status: Released; Package: SB0603; ComponentLink1Description: Datasheet; ComponentLink1URL: http://tunmcdsvn.tun.st.com/Component_Datasheet_Library/Trunk/Resistors/Yageo_Resistor_RC0603-series
T9-T11 = MCD-01028: N-channel 20 V, 0.025 O typ., 6 A STripFET™ V Power MOSFET in a PowerFLAT™ 2x2 package; Part_Type: IC; Manufacturer: STMICROELECTRONICS; BMS_Part_Number: 9153558; Provided_By: SUBCO with ST control; Internal_Part_Number: MCD-01028; Status: Checked; Manufacturer_Part_Number: STL6N2VH5; Package: PowerFLAT 2x2; ComponentLink1Description: Datasheet; ComponentLink1URL: http://tunmcdsvn.tun.st.com/Component_Datasheet_Library/Trunk/IC/STM_POWER_MOSFET_N_STL6N2VH5
TP3 = MCD-01506: Test Point trought hole 1mm/2mm; Part_Type: Mechanical; Internal_Part_Number: MCD-01506; Status: Released; Manufacturer_Part_Number: n/a; Manufacturer: n/a; ComponentLink1Description: Datasheet; ComponentLink1URL: n/a; Provided_By: n/a